# EAGLE design seeknobs3qtpy_30Jan2022 (EAGLE 9.6.2)
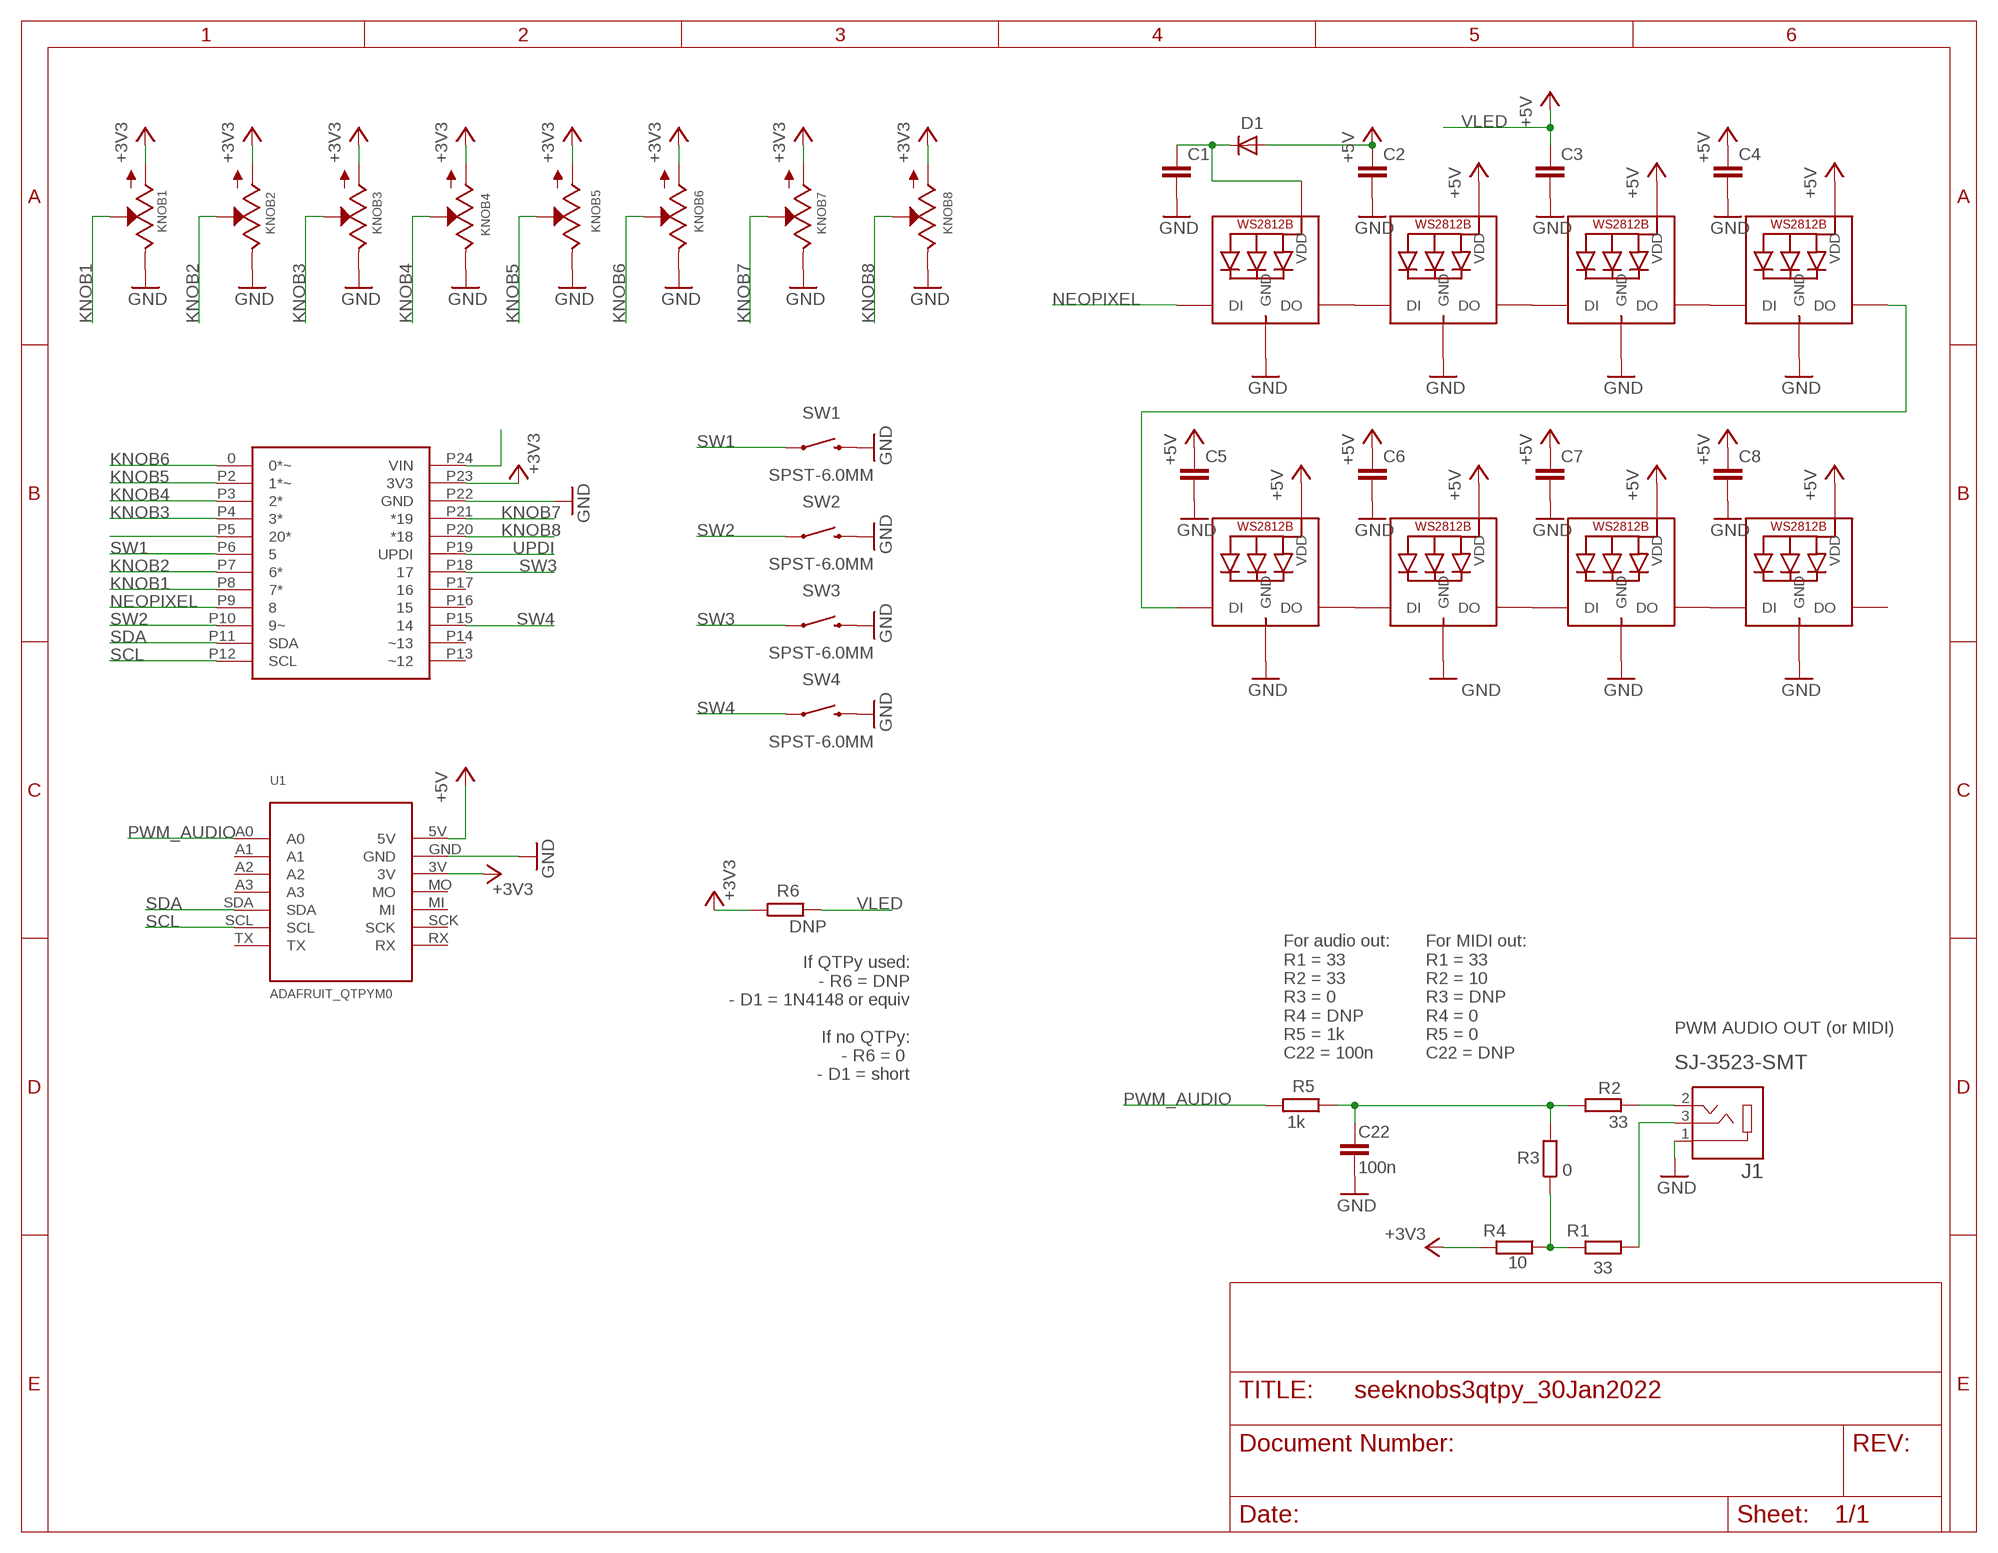
[diagram p0: schematic, sheet 1]

## Parts
C1  C-EUC0805  [C0805]
C2  C-EUC0805  [C0805]
C3  C-EUC0805  [C0805]
C4  C-EUC0805  [C0805]
C5  C-EUC0805  [C0805]
C6  C-EUC0805  [C0805]
C7  C-EUC0805  [C0805]
C8  C-EUC0805  [C0805]
C22  100n  C-EUC0805  [C0805]
D1  DIODESOD-123  [SOD-123]
J1  SJ-3523-SMT  [CUI_SJ-3523-SMT]
KNOB1  POT  [ALPS_POT]
KNOB2  POT  [ALPS_POT]
KNOB3  POT  [ALPS_POT]
KNOB4  POT  [ALPS_POT]
KNOB5  POT  [ALPS_POT]
KNOB6  POT  [ALPS_POT]
KNOB7  POT  [ALPS_POT]
KNOB8  POT  [ALPS_POT]
LED1  MICROBUILDER_WS2812B5050  [MICROBUILDER_WS2812B]
LED2  MICROBUILDER_WS2812B5050  [MICROBUILDER_WS2812B]
LED3  MICROBUILDER_WS2812B5050  [MICROBUILDER_WS2812B]
LED4  MICROBUILDER_WS2812B5050  [MICROBUILDER_WS2812B]
LED5  MICROBUILDER_WS2812B5050  [MICROBUILDER_WS2812B]
LED6  MICROBUILDER_WS2812B5050  [MICROBUILDER_WS2812B]
LED7  MICROBUILDER_WS2812B5050  [MICROBUILDER_WS2812B]
LED8  MICROBUILDER_WS2812B5050  [MICROBUILDER_WS2812B]
R1  33  R-EU_R0805  [R0805]
R2  33  R-EU_R0805  [R0805]
R3  0  R-EU_R0805  [R0805]
R4  10  R-EU_R0805  [R0805]
R5  1k  R-EU_R0805  [R0805]
R6  DNP  R-EU_R0805  [R0805]
SEESAW  ADAFRUIT_SEESAW_ATTINY817  [ADAFRUIT_SEESAW_ATTINY817]
SW1  SPST-6.0MM  MOMENTARY-SWITCH-SPST-PTH-6.0MM  [TACTILE_SWITCH_PTH_6.0MM]
SW2  SPST-6.0MM  MOMENTARY-SWITCH-SPST-PTH-6.0MM  [TACTILE_SWITCH_PTH_6.0MM]
SW3  SPST-6.0MM  MOMENTARY-SWITCH-SPST-PTH-6.0MM  [TACTILE_SWITCH_PTH_6.0MM]
SW4  SPST-6.0MM  MOMENTARY-SWITCH-SPST-PTH-6.0MM  [TACTILE_SWITCH_PTH_6.0MM]
U1  ADAFRUIT_QTPYM0  [ADAFRUIT_QTPY_M0]

## Nets
+3V3: KNOB1.P$3(A) KNOB2.P$3(A) KNOB3.P$3(A) KNOB4.P$3(A) KNOB5.P$3(A) KNOB6.P$3(A) KNOB7.P$3(A) KNOB8.P$3(A) R4.2 R6.2 SEESAW.P23(3V3) U1.3V
GND: C1.2 C2.2 C3.2 C4.2 C5.2 C6.2 C7.2 C8.2 C22.2 J1.1 KNOB1.P$1(E) KNOB2.P$1(E) KNOB3.P$1(E) KNOB4.P$1(E) KNOB5.P$1(E) KNOB6.P$1(E) KNOB7.P$1(E) KNOB8.P$1(E) LED1.3-GND(GND) LED2.3-GND(GND) LED3.3-GND(GND) LED4.3-GND(GND) LED5.3-GND(GND) LED6.3-GND(GND) LED7.3-GND(GND) LED8.3-GND(GND) SEESAW.P22(GND) SW1.3 SW2.3 SW3.3 SW4.3 U1.GND
KNOB1: KNOB1.P$2(S) SEESAW.P8(7*)
KNOB2: KNOB2.P$2(S) SEESAW.P7(6*)
KNOB3: KNOB3.P$2(S) SEESAW.P4(3*)
KNOB4: KNOB4.P$2(S) SEESAW.P3(2*)
KNOB5: KNOB5.P$2(S) SEESAW.P2(1*~)
KNOB6: KNOB6.P$2(S) SEESAW.0(0*~)
KNOB7: KNOB7.P$2(S) SEESAW.P21(*19)
KNOB8: KNOB8.P$2(S) SEESAW.P20(*18)
N$1: LED1.2-DOUT(DO) LED2.4-DIN(DI)
N$2: LED6.2-DOUT(DO) LED7.4-DIN(DI)
N$3: LED2.2-DOUT(DO) LED3.4-DIN(DI)
N$4: LED3.2-DOUT(DO) LED4.4-DIN(DI)
N$5: LED7.2-DOUT(DO) LED8.4-DIN(DI)
N$6: LED5.2-DOUT(DO) LED6.4-DIN(DI)
N$7: LED4.2-DOUT(DO) LED5.4-DIN(DI)
N$8: J1.3 R1.1
N$9: C1.1 D1.C LED1.1-VDD(VDD)
N$10: J1.2 R2.1
N$11: R1.2 R3.1 R4.1
N$12: SEESAW.P5(20*)
N$14: SEESAW.P24(VIN)
N$48: C22.1 R2.2 R3.2 R5.1
NEOPIXEL: LED1.4-DIN(DI) SEESAW.P9
PWM_AUDIO: R5.2 U1.A0
SCL: SEESAW.P12(SCL) U1.SCL
SDA: SEESAW.P11(SDA) U1.SDA
SW1: SEESAW.P6 SW1.1
SW2: SEESAW.P10(9~) SW2.1
SW3: SEESAW.P18 SW3.1
SW4: SEESAW.P15 SW4.1
UPDI: SEESAW.P19(UPDI)
VLED: C2.1 C3.1 C4.1 C5.1 C6.1 C7.1 C8.1 D1.A LED2.1-VDD(VDD) LED3.1-VDD(VDD) LED4.1-VDD(VDD) LED5.1-VDD(VDD) LED6.1-VDD(VDD) LED7.1-VDD(VDD) LED8.1-VDD(VDD) R6.1 U1.5V ; supply symbol labelled +5V
Unconnected: LED8.2-DOUT(DO) SEESAW.P13(~12) SEESAW.P14(~13) SEESAW.P16 SEESAW.P17 U1.A1 U1.A2 U1.A3 U1.MI U1.MO U1.RX U1.SCK U1.TX

## Notes on the sheet
- If QTPy used:
  - R6 = DNP
  - D1 = 1N4148 or equiv
  
  If no QTPy:
  - R6 = 0 
  - D1 = short
- PWM AUDIO OUT (or MIDI)
- For audio out:
  R1 = 33
  R2 = 33
  R3 = 0
  R4 = DNP
  R5 = 1k
  C22 = 100n
- For MIDI out:
  R1 = 33
  R2 = 10
  R3 = DNP
  R4 = 0
  R5 = 0
  C22 = DNP

## Library data of the parts
C1-C8 C22 = rcl:C-EU: CAPACITOR, European symbol; SPICEPREFIX: C
D1 = adafruit:DIODE: Diode SMADIODE - SMA Surface Mount Package 20V 1A Schottky Diode Digikey: 641-1014-6-ND DO-1N4148 - Through Hole Small Current Diode SOD-123 20V 1 A (.5mV Vf) Schottky Diode - Digikey: MBRX120TPMSCT-ND SOD-323 10V 570mA (.38mV Vf, 3ns) Schottky Diode - Digikey: ZLLS410CT-ND SOD-523 30V 30mA Schottky Diode (RB751S-40TE61) - Digikey: RB751S-40TE61CT-ND SOT23-R/W - SOT23 Package (R = Solder Paste/Reflow Ovens, W = Hand-Soldering) BAT54Film 40V 300mA - Digikey: 497-7162-1-ND
J1 = SJ-3523-SMT:SJ-3523-SMT: Audio Jack Connector 3.5 mm Low Profile Surface Mount Stereo Jack, 3 Pin Right-Angle; CUI_PURCHASE_URL: https://www.cuidevices.com/product/interconnect/connectors/audio-connectors/jacks/sj-352x-smt-series?utm_source=snapeda.com&utm_medium=referral&utm_campaign=snapedaBOM; DESCRIPTION: 3.5 mm, Stereo, Right Angle, Surface Mount (SMT), 3 Conductors, 0~1 Internal Switches, Audio Jack Connector; DIGI-KEY_PART_NUMBER: CP-3523SJCT-ND; MF: CUI Devices; MP: SJ-3523-SMT-TR; PACKAGE: None; PURCHASE-URL: https://pricing.snapeda.com/search/part/SJ-3523-SMT-TR/?ref=eda
KNOB1-KNOB8 = EurorackModularParts:POT
LED1-LED8 = Adafruit MacroPad 2040:MICROBUILDER_WS2812B
R1-R6 = rcl:R-EU_: RESISTOR, European symbol; SPICEPREFIX: R
SEESAW = todstuff:ADAFRUIT_SEESAW_ATTINY817
SW1-SW4 = SparkFun-Switches:MOMENTARY-SWITCH-SPST: Momentary Switch (Pushbutton) - SPST Normally-open (NO) SPST momentary switches (buttons, pushbuttons). Variants PTH-12MM - 12mm square, through-hole Momentary Pushbutton Switch - 12mm Square <https://www.sparkfun.com/products/9190> (COM-09190) PTH-6.0MM, PTH-6.0MM-KIT - 6.0mm square, through-hole Mini Pushbutton Switch <https://www.sparkfun.com/products/97> (COM-00097) KIT package intended for soldering kit's - only one side of pads' copper is exposed. PTH-RIGHT-ANGLE-KIT - Right-angle, through-hole Right Angle Tactile Button <https://www.sparkfun.com/products/10791> - Used on SparkFun BigTime Watch Kit <https://www.sparkfun.com/products/11734> SMD-12MM - 12mm square, surface-mount Tactile Button - SMD (12mm) <https://www.sparkfun.com/products/12993> (COM-12993) Used on SparkFun PicoBoard <https://www.sparkfun.com/products/11888> SMD-4.5MM - 4.5mm Square Trackball Switch Used on SparkFun Blackberry Trackballer Breakout <https://www.sparkfun.com/products/13169> SMD-4.6MMX2.8MM - 4.60mm x 2.80mm, surface mount Used on SparkFun SAMD21 Mini Breakout <https://www.sparkfun.com/products/13664> SMD-5.2MM, SMD-5.2-REDUNDANT - 5.2mm square, surface-mount Mini Pushbutton Switch - SMD <https://www.sparkfun.com/products/8720> (COM-08720) Used on Arduino Pro Mini <https://www.sparkfun.com/products/11114> REDUNDANT package connects both switch circuits together SMD-6.0X3.5MM - 6.0 x 3.5mm, surface mount Momentary Reset Switch SMD <https://www.sparkfun.com/products/8229> (COM-08229) SMD-6.2MM-TALL - 6.2mm square, surface mount Tactile Button - SMD (6mm) <https://www.sparkfun.com/products/12992> Used on SparkFun Digital Sandbox <https://www.sparkfun.com/products/12651> SMD-RIGHT-ANGLE - Right-angle, surface mount Used on SparkFun Block for Intel® Edison - Arduino <https://www.sparkfun.com/products/13036>; PROD_ID: SWCH-08441; SF_SKU: COM-00097
U1 = todstuff:ADAFRUIT_QTPY

## Board
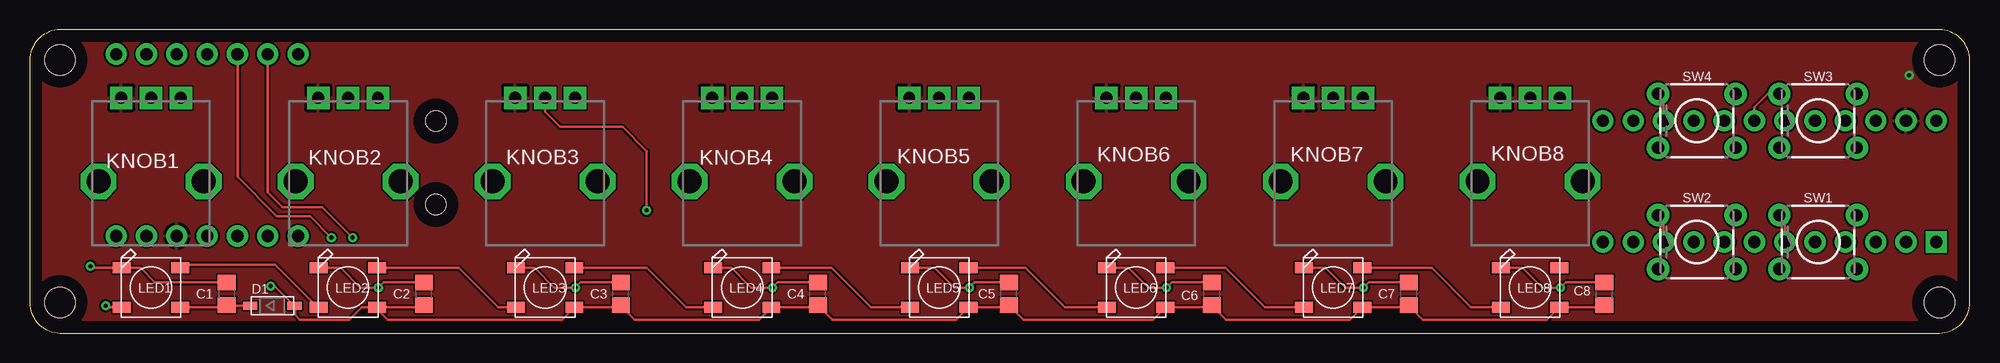
[diagram p1: board, top side]
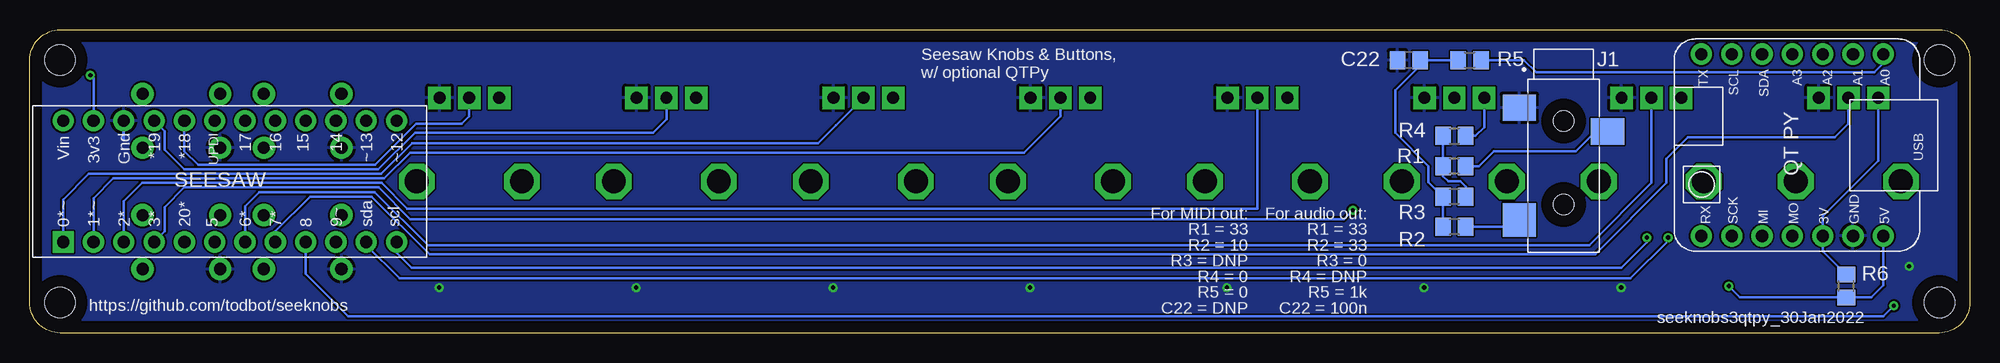
[diagram p2: board, bottom side, seen from below]

Size 162.56 x 25.4 mm. Coordinates in mm from the lower left corner, seen from the top.
Outline: 0,22.86 0,2.54 arc90 2.54,0 160.02,0 arc90 162.56,2.54 162.56,22.86 arc90 160.02,25.4 2.54,25.4 arc90 0,22.86
Copper layers (1*16): Top 0.035mm / dielectric 1.5mm / Bottom 0.035mm
Design rules "default": minimum track width 6mil, minimum drill 0.35mm, track to track 6mil, track to pad 6mil, pad to pad 6mil, via to via 6mil, smd to smd 6mil, copper to edge 40mil, drill to drill 6mil, minimum pad ring 10mil, minimum via ring 8mil, stop-mask expansion 4mil, vias tented up to drill 0mil, thermal gap 10mil
Holes 2.54 mm at 160.02,22.86 160.02,2.54 2.54,2.54 2.54,22.86

### Footprints (pad centres in the part's own frame; a part is rotated, then mirrored left to right if it is on the bottom)
C0805 = smd 1.3 x 1.5: 1 -0.95,0; 2 0.95,0
SOD-123 = smd 1.2 x 0.7: A 1.85,0; C -1.85,0
CUI_SJ-3523-SMT = smd 2.2 x 2.8: 1 -1.1,-3.7; 3 0.9,3.7 | smd 2.8 x 2.8: 2 8.3,-3.7 | hole 1.7: 0,0; 7,0
ALPS_POT = drill 1 pad 1.88 square: P$1 7,-2.5; P$2 7,0; P$3 7,2.5 | drill 2 octagon: P$4 0,-4.4; P$5 0,4.4
MICROBUILDER_WS2812B = smd 1.5 x 0.9: 1-VDD 2.45,-1.65; 2-DOUT 2.45,1.65; 3-GND -2.45,1.65; 4-DIN -2.45,-1.65
R0805 = smd 1.3 x 1.5: 1 -0.95,0; 2 0.95,0
ADAFRUIT_SEESAW_ATTINY817 = drill 1.016 pad 1.778 square: 0 -5.08,13.97 | drill 1.016 pad 1.778: P2 -5.08,11.43; P3 -5.08,8.89; P4 -5.08,6.35; P5 -5.08,3.81; P6 -5.08,1.27; P7 -5.08,-1.27; P8 -5.08,-3.81; P9 -5.08,-6.35; P10 -5.08,-8.89; P11 -5.08,-11.43; P12 -5.08,-13.97; P13 5.08,-13.97; P14 5.08,-11.43; P15 5.08,-8.89; P16 5.08,-6.35; P17 5.08,-3.81; P18 5.08,-1.27; P19 5.08,1.27; P20 5.08,3.81; P21 5.08,6.35; P22 5.08,8.89; P23 5.08,11.43; P24 5.08,13.97
TACTILE_SWITCH_PTH_6.0MM = drill 1.016 pad 1.88: 1 -3.251,2.261; 2 3.251,2.261; 3 -3.251,-2.261; 4 3.251,-2.261
ADAFRUIT_QTPY_M0 = drill 1.016 pad 1.778: 3V 7.62,2.54; 5V 7.62,7.62; A0 -7.62,7.62; A1 -7.62,5.08; A2 -7.62,2.54; A3 -7.62,0; GND 7.62,5.08; MI 7.62,-2.54; MO 7.62,0; RX 7.62,-7.62; SCK 7.62,-5.08; SCL -7.62,-5.08; SDA -7.62,-2.54; TX -7.62,-7.62

### Placement (x,y rotation side)
C1  16.51,3.3 90 top
C2  33.02,3.3 90 top
C3  49.53,3.3 90 top
C4  66.04,3.3 90 top
C5  82.04,3.3 90 top
C6  99.06,3.3 90 top
C7  115.57,3.3 90 top
C8  131.95,3.3 90 top
C22  46.99,22.86 180 bottom
D1  20.32,2.29 0 top
J1  34.04,17.78 270 bottom
KNOB1  10.16,12.7 90 top
KNOB2  26.67,12.7 90 top
KNOB3  43.18,12.7 90 top
KNOB4  59.69,12.7 90 top
KNOB5  76.2,12.7 90 top
KNOB6  92.71,12.7 90 top
KNOB7  109.22,12.7 90 top
KNOB8  125.73,12.7 90 top
LED1  10.16,3.81 0 top
LED2  26.67,3.81 0 top
LED3  43.18,3.81 0 top
LED4  59.69,3.81 0 top
LED5  76.2,3.81 0 top
LED6  92.71,3.81 0 top
LED7  109.22,3.81 0 top
LED8  125.73,3.81 0 top
R1  43.18,13.97 180 bottom
R2  43.18,8.89 180 bottom
R3  43.18,11.43 180 bottom
R4  43.18,16.51 0 bottom
R5  41.91,22.86 0 bottom
R6  10.35,3.94 90 bottom
SEESAW  145.8,12.7 90 bottom
SW1  149.86,7.62 0 top
SW2  139.7,7.62 0 top
SW3  149.86,17.78 0 top
SW4  139.7,17.78 0 top
U1  14.86,15.75 270 bottom

### Tracks (layer width: path | path; a pad name or v marks a point on that pad's centre or on a via)
+3V3  (via drill 0.35)
  Bottom 0.203: v157.48,21.59 157.23,21.34 SEESAW.P23 | KNOB1.P$3 7.66,14.44 12.32,9.78 U1.3V 12.32,6.86 R6.2 | R4.2 41.4,16.51 40.68,17.23 KNOB3.P$3
  pour Top: 165.1,26.67 165.1,-1.02 -1.4,-1.02 -1.4,26.67
GND  (via drill 0.35)
  Top 0.203: C1.2 10.48,4.25 9.27,5.46 LED1.3-GND 5.21,5.46 v5.08,5.59 | LED2.3-GND 26.04,5.46 27.69,3.81 v29.21,3.81 29.65,4.25 C2.2 | LED3.3-GND 42.29,5.46 43.94,3.81 v45.72,3.81 46.16,4.25 C3.2 | LED4.3-GND 58.8,5.46 60.45,3.81 v62.23,3.81 62.67,4.25 C4.2 | LED5.3-GND 75.82,5.46 77.47,3.81 v78.74,3.81 79.18,4.25 C5.2 | LED6.3-GND 92.08,5.46 93.73,3.81 v95.25,3.81 95.69,4.25 C6.2 | LED7.3-GND 108.59,5.46 110.24,3.81 v111.76,3.81 112.2,4.25 C7.2 | LED8.3-GND 125.1,5.46 126.75,3.81 v128.27,3.81 128.71,4.25 C8.2
  Bottom 0.203: 154.69,16.13 SEESAW.P22
  pour Bottom: -1.27,26.67 163.83,26.67 163.83,-1.02 -1.27,-1.02
KNOB1
  Bottom 0.203: KNOB1.P$2 10.16,17.53 11.3,16.38 23.62,16.38 25.4,14.61 25.4,12.57 31.37,6.6 129.07,6.6 133.9,11.43 139.06,11.43 141.99,8.51 SEESAW.P8
KNOB2
  Bottom 0.203: KNOB2.P$2 26.67,12.57 31.88,7.37 129.2,7.37 133.64,11.81 143.34,11.81 144.53,10.63 SEESAW.P7
KNOB3  (via drill 0.35)
  Top 0.203: KNOB3.P$2 43.18,18.54 44.45,17.27 49.66,17.27 51.69,15.24 v51.69,10.29
  Bottom 0.203: SEESAW.P4 151.26,8.51 151.26,10.54 149.61,12.19 133.34,12.19 130.68,9.53 52.45,9.53 v51.69,10.29
KNOB4
  Bottom 0.203: KNOB4.P$2 59.69,10.41 130.94,10.41 133.1,12.57 153.16,12.57 154.69,11.05 SEESAW.P3
KNOB5
  Bottom 0.203: KNOB5.P$2 76.2,18.18 79.26,15.11 130.71,15.11 132.87,12.95 155.57,12.95 157.23,11.3 SEESAW.P2
KNOB6
  Bottom 0.203: KNOB6.P$2 95.01,17.4 95,17.4 96.5,15.9 130.54,15.9 133.1,13.34 157.61,13.34 159.77,11.18 SEESAW.0
KNOB7
  Bottom 0.203: KNOB7.P$2 109.22,17.91 110.34,16.79 130.28,16.79 133.35,13.72 149.61,13.72 151.26,15.37 151.26,16.89 SEESAW.P21
KNOB8
  Bottom 0.203: KNOB8.P$2 125.73,18.16 126.36,17.53 130.18,17.53 133.6,14.1 148.46,14.1 149.61,15.24 SEESAW.P20
N$1
  Top 0.203: LED2.4-DIN 24.13,2.16 20.57,5.71 12.86,5.71 LED1.2-DOUT
N$2
  Top 0.203: LED6.2-DOUT 100.2,5.46 103.5,2.16 LED7.4-DIN
N$3
  Top 0.203: LED2.2-DOUT 35.94,5.46 39.24,2.16 LED3.4-DIN
N$4
  Top 0.203: LED3.2-DOUT 51.69,5.46 54.99,2.16 LED4.4-DIN
N$5
  Top 0.203: LED7.2-DOUT 117.48,5.46 120.78,2.16 LED8.4-DIN
N$6
  Top 0.203: LED5.2-DOUT 83.44,5.46 86.74,2.16 LED6.4-DIN
N$7
  Top 0.203: LED4.2-DOUT 67.18,5.46 70.48,2.16 LED5.4-DIN
N$8
  Bottom 0.203: R1.1 41.15,13.97 39.88,15.24 32.99,15.24 31.35,16.88 J1.3
N$9
  Top 0.203: LED1.1-VDD 16.32,2.16 C1.1 16.58,2.29 D1.C
N$10
  Bottom 0.203: R2.1 38.33,8.89 J1.2
N$11
  Bottom 0.203: R4.1 R1.2 44.13,13.14 43.69,12.7 42.67,12.7 42.23,12.26 R3.1
N$48
  Bottom 0.203: R2.2 R3.2 45.34,12.64 45.34,13.97 48.13,16.76 48.13,20.32 46.04,22.41 C22.1 R5.1
NEOPIXEL  (via drill 0.35)
  Top 0.203: LED1.4-DIN 6.48,2.16 v6.35,2.29
  Bottom 0.203: v6.35,2.29 7.24,1.39 135.89,1.39 139.45,4.95 SEESAW.P9
PWM_AUDIO
  Bottom 0.203: U1.A0 7.24,22.61 8,21.84 36.32,21.84 37.34,22.86 R5.2
SCL  (via drill 0.35)
  Top 0.203: v27.05,8 24.51,10.54 21.21,10.54 19.94,11.81 U1.SCL
  Bottom 0.203: SEESAW.P12 131.83,6.73 130.56,5.46 29.21,5.46 27.05,7.62 v27.05,8
SDA  (via drill 0.35)
  Top 0.203: U1.SDA 17.4,13.08 20.7,9.78 23.5,9.78 v25.27,8
  Bottom 0.203: v25.27,8 25.27,7.75 28.45,4.57 131.57,4.57 134.37,7.37 SEESAW.P11
SW1
  Top 0.203: SW1.1 147.07,9.42 SEESAW.P6
SW2
  Top 0.203: SW2.1 136.91,9.42 SEESAW.P10
SW3
  Top 0.203: SW3.1 145.64,20.04 144.53,18.92 SEESAW.P18
SW4
  Top 0.203: SW4.1 136.45,19.76 136.91,19.3 SEESAW.P15
VLED  (via drill 0.35)
  Top 0.203: C8.1 131.76,2.16 LED8.1-VDD 127.14,1.12 116.74,1.12 115.54,2.32 | 115.54,2.32 115.38,2.16 LED7.1-VDD 110.63,1.12 100.23,1.12 99.03,2.32 | 115.54,2.32 C7.1 | 99.03,2.32 98.87,2.16 LED6.1-VDD 94.12,1.12 83.28,1.12 C5.1 81.85,2.16 LED5.1-VDD 77.61,1.12 67.27,1.12 C4.1 65.85,2.16 LED4.1-VDD 61.1,1.12 50.7,1.12 49.5,2.32 | 99.03,2.32 C6.1 | 49.5,2.32 49.34,2.16 LED3.1-VDD 44.59,1.12 30,1.12 28.96,2.16 | 49.5,2.32 C3.1 | C2.1 32.83,2.16 LED2.1-VDD 28.96,2.16 | 28.96,2.16 27.81,2.16 26.77,1.12 22.63,1.12 22.23,1.52 22.23,2.23 D1.A 20.52,3.94 v20.19,3.94
  Bottom 0.203: v20.19,3.94 19.24,2.99 R6.1 8.25,2.99 7.24,4 U1.5V

### Text on the board
bPlace: Seesaw Knobs & Buttons, / w/ optional QTPy | For audio out: / R1 = 33 / R2 = 33 / R3 = 0 / R4 = DNP / R5 = 1k / C22 = 100n | For MIDI out: / R1 = 33 / R2 = 10 / R3 = DNP / R4 = 0 / R5 = 0 / C22 = DNP | https://github.com/todbot/seeknobs | seeknobs3qtpy_30Jan2022